# Altium project Oscilloscope.PrjPcb
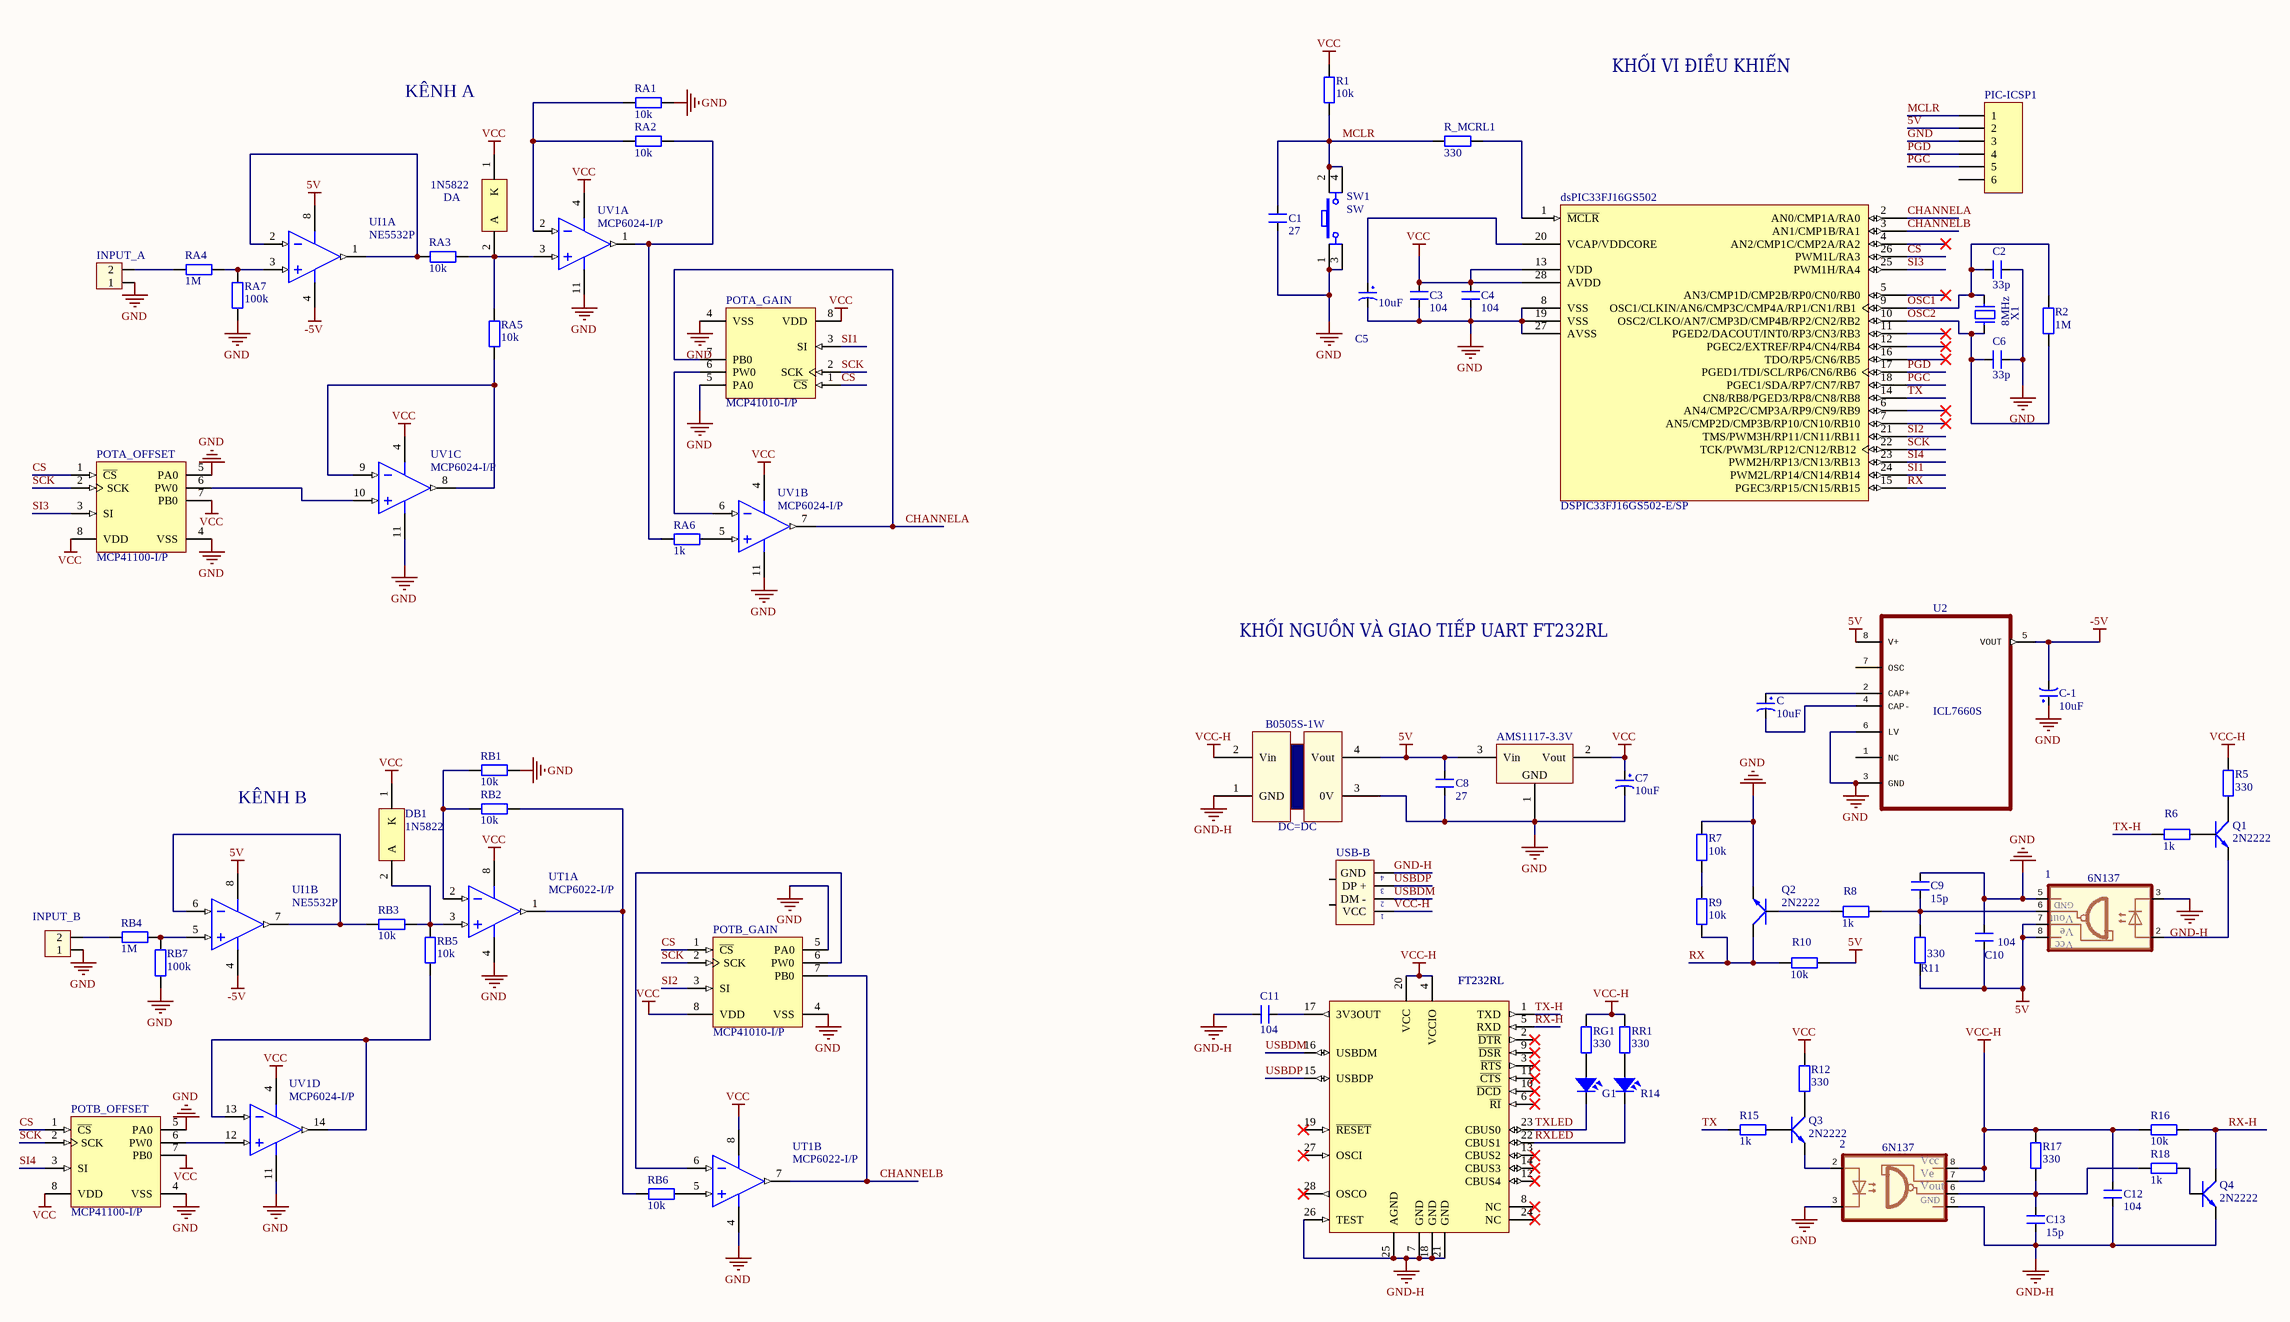
[diagram p0: Oscilloscope.SchDoc]
1 sheet, 74 parts. Net scope: global (net labels, ports and power ports of the same name join across sheets).
Board file: Oscilloscope.PcbDoc

## Sheet Oscilloscope.SchDoc
size A2; PageSetup: Record=PageOptions|CenterHorizontal=True|CenterVertical=True|PrintScale=1.00|XCorrection=1.00|YCorrection=1.00|PrintKind=2|BorderSize=5000000|LeftOffset=0|BottomOffset=0|Orientation=1|PaperLength=1000|PaperWidth=1000|Scale=100|PaperSource=7|PrintQuality=600|MediaType=1|DitherType=10|PrintScaleMode=0|PaperKind=A3|PaperIndex=8

### Parts
1  6N137  [DIP8/W0.3]
2  6N137  [DIP8/W0.3]
AMS1117-3.3V  AMS1117-3V3  [TO-252]  (value not drawn)
B0505S-1W  DC=DC  [B050S-1W]
C  10uF  [CP1/2]
C1  27  [CN1.5]
C2  33p  [CN1.5]
C3  104  [CN1.5]
C4  104  [CN1.5]
C5  10uF  [CP1/2]
C6  33p  [CN1.5]
C7  10uF  [CP1/2]
C8  27  [CN1.5]
C9  15p  [CN1.5]
C10  104  [CN1.5]
C11  104  [CN1.5]
C12  104  [CN1.5]
C13  15p  [CN1.5]
C-1  10uF  [CP1/2]
DA  1N5822  [ONSC-AXIAL_LEAD-2-267-05_V]
DB1  1N5822  [ONSC-AXIAL_LEAD-2-267-05_V]
dsPIC33FJ16GS502  DSPIC33FJ16GS502-E/SP  [DIP28W]
FT232RL  FT232RL  [DIP28W]
G1  LED  [LED-5-Green]  (value not drawn)
INPUT_A  Header 2  [HED2]  (value not drawn)
INPUT_B  Header 2  [HED2]  (value not drawn)
PIC-ICSP1  PIC-ICSP-UART  [HDR1X6 - L]  (value not drawn)
POTA_GAIN  MCP41010-I/P  [PDIP300-P8]
POTA_OFFSET  MCP41100-I/P  [PDIP300-P8]
POTB_GAIN  MCP41010-I/P  [PDIP300-P8]
POTB_OFFSET  MCP41100-I/P  [PDIP300-P8]
Q1  2N2222  [QTO-92]
Q2  2N2222  [QTO-92]
Q3  2N2222  [QTO-92]
Q4  2N2222  [QTO-92]
R1  10k  [R1/2W]
R2  1M  [R1/2W]
R5  330  [R1/4W]
R6  1k  [R1/4W]
R7  10k  [R1/4W]
R8  1k  [R1/4W]
R9  10k  [R1/4W]
R10  10k  [R1/4W]
R11  330  [R1/4W]
R12  330  [R1/4W]
R14  LED  [LED-5-RED]  (value not drawn)
R15  1k  [R1/4W]
R16  10k  [R1/4W]
R17  330  [R1/4W]
R18  1k  [R1/4W]
R_MCRL1  330  [R1/2W]
RA1  10k  [R1/2W]
RA2  10k  [R1/2W]
RA3  10k  [R1/2W]
RA4  1M  [R1/2W]
RA5  10k  [R1/2W]
RA6  1k  [R1/2W]
RA7  100k  [R1/2W]
RB1  10k  [R1/2W]
RB2  10k  [R1/2W]
RB3  10k  [R1/2W]
RB4  1M  [R1/2W]
RB5  10k  [R1/2W]
RB6  10k  [R1/2W]
RB7  100k  [R1/2W]
RG1  330  [R1/4W]
RR1  330  [R1/4W]
SW1  SW  [SW4]
U2  ICL7660S  [DIP-8]
UI1  NE5532P  [TI-P8]  (parts A,B of 2)
USB-B  USB  [USB-B-MALE]  (value not drawn)
UT1  MCP6022-I/P  [PDIP300-P8]  (parts A,B of 2)
UV1  MCP6024-I/P  [PDIP300-P14]  (parts A,B,C,D of 4)
X1  8MHz  [XT2]

### Nets
5V: 1.7(VE) 1.8(VCC) AMS1117-3.3V.3(Vin) B0505S-1W.4(Vout) C8.2 C10.1 PIC-ICSP1.2 R10.2 R11.1 U2.8(V+) UI1.8(VCC+)
-5V: C-1.2 U2.5(VOUT) UI1.4(VCC-)
GND: 1.5(GND) 2.3(C) AMS1117-3.3V.1(GND) B0505S-1W.3(0V) C1.1 C2.2 C3.1 C4.1 C5.2 C6.2 C7.2 C8.1 C9.2 C10.2 C-1.1 dsPIC33FJ16GS502.8(VSS) dsPIC33FJ16GS502.19(VSS) dsPIC33FJ16GS502.27(AVSS) INPUT_A.1 INPUT_B.1 PIC-ICSP1.3 POTA_GAIN.4(VSS) POTA_GAIN.5(PA0) POTA_OFFSET.4(VSS) POTA_OFFSET.5(PA0) POTB_GAIN.4(VSS) POTB_GAIN.5(PA0) POTB_OFFSET.4(VSS) POTB_OFFSET.5(PA0) Q2.1(E) R7.2 RA1.1 RA7.1 RB1.1 RB7.1 SW1.1 SW1.3 U2.3(GND) U2.6(LV) UT1.4(VSS) UV1.11(VSS)
GND-H: 1.3(C) 2.5(GND) B0505S-1W.1(GND) C11.1 C12.1 C13.1 FT232RL.7(GND) FT232RL.18(GND) FT232RL.21(GND) FT232RL.25(AGND) FT232RL.26(TEST) Q4.1(E) USB-B.4(GND)
VCC: AMS1117-3.3V.2(Vout) C3.2 C4.2 C7.1 DA.1(K) DB1.1(K) dsPIC33FJ16GS502.13(VDD) dsPIC33FJ16GS502.28(AVDD) POTA_GAIN.8(VDD) POTA_OFFSET.7(PB0) POTA_OFFSET.8(VDD) POTB_GAIN.8(VDD) POTB_OFFSET.7(PB0) POTB_OFFSET.8(VDD) R1.2 R12.2 UT1.8(VDD) UV1.4(VDD)
VCC-H: 2.7(VE) 2.8(VCC) B0505S-1W.2(Vin) C12.2 FT232RL.4(VCCIO) FT232RL.20(VCC) R5.2 R16.1 R17.2 RG1.2 RR1.2 USB-B.1(VCC)
CHANNELA: dsPIC33FJ16GS502.2(AN0/CMP1A/RA0) POTA_GAIN.7(PB0) UV1.7(VOUTB)
CHANNELB: dsPIC33FJ16GS502.3(AN1/CMP1B/RA1) POTB_GAIN.7(PB0) UT1.7(VOUTB)
CS: dsPIC33FJ16GS502.26(PWM1L/RA3) POTA_GAIN.1(~{CS}) POTA_OFFSET.1(~{CS}) POTB_GAIN.1(~{CS}) POTB_OFFSET.1(~{CS})
MCLR: C1.2 PIC-ICSP1.1 R1.1 R_MCRL1.2 SW1.2 SW1.4
OSC1: C2.1 dsPIC33FJ16GS502.9(OSC1/CLKIN/AN6/CMP3C/CMP4A/RP1/CN1/RB1) R2.2 X1.2
OSC2: C6.1 dsPIC33FJ16GS502.10(OSC2/CLKO/AN7/CMP3D/CMP4B/RP2/CN2/RB2) R2.1 X1.1
PGC: dsPIC33FJ16GS502.18(PGEC1/SDA/RP7/CN7/RB7) PIC-ICSP1.5
PGD: dsPIC33FJ16GS502.17(PGED1/TDI/SCL/RP6/CN6/RB6) PIC-ICSP1.4
RX: dsPIC33FJ16GS502.15(PGEC3/RP15/CN15/RB15) Q2.3(C) R9.1 R10.1
RX-H: FT232RL.5(RXD) Q4.3(C) R16.2
RXLED: FT232RL.22(CBUS1) R14.2
SCK: dsPIC33FJ16GS502.22(TCK/PWM3L/RP12/CN12/RB12) POTA_GAIN.2(SCK) POTA_OFFSET.2(SCK) POTB_GAIN.2(SCK) POTB_OFFSET.2(SCK)
SI1: dsPIC33FJ16GS502.24(PWM2L/RP14/CN14/RB14) POTA_GAIN.3(SI)
SI2: dsPIC33FJ16GS502.21(TMS/PWM3H/RP11/CN11/RB11) POTB_GAIN.3(SI)
SI3: dsPIC33FJ16GS502.25(PWM1H/RA4) POTA_OFFSET.3(SI)
SI4: dsPIC33FJ16GS502.23(PWM2H/RP13/CN13/RB13) POTB_OFFSET.3(SI)
TX: dsPIC33FJ16GS502.14(CN8/RB8/PGED3/RP8/CN8/RB8) R15.1
TX-H: FT232RL.1(TXD) R6.1
TXLED: FT232RL.23(CBUS0) G1.2
USBDM: FT232RL.16(USBDM) USB-B.2(DM_-)
USBDP: FT232RL.15(USBDP) USB-B.3(DP_+)
Net1_2: 1.2(A) Q1.1(E)
Net1_6: 1.6(VO) C9.1 R8.2 R11.2
Net2_2: 2.2(A) Q3.1(E)
Net2_6: 2.6(VO) C13.2 R17.1 R18.1
NetC5_1: C5.1 dsPIC33FJ16GS502.20(VCAP/VDDCORE)
NetC11_2: C11.2 FT232RL.17(3V3OUT)
NetC_1: C.1 U2.2(CAP+)
NetC_2: C.2 U2.4(CAP-)
NetDA_2: DA.2(A) RA3.1 RA5.1 UV1.3(VINA+)
NetDB1_2: DB1.2(A) RB3.1 RB5.2 UT1.3(VINA+)
NetdsPIC33FJ16GS502_1: dsPIC33FJ16GS502.1(~{MCLR}) R_MCRL1.1
NetG1_1: G1.1 RG1.1
NetINPUT_A_2: INPUT_A.2 RA4.2
NetINPUT_B_2: INPUT_B.2 RB4.2
NetPOTA_GAIN_6: POTA_GAIN.6(PW0) UV1.6(VINB-)
NetPOTA_OFFSET_6: POTA_OFFSET.6(PW0) UV1.10(VINC+)
NetPOTB_GAIN_6: POTB_GAIN.6(PW0) UT1.6(VINB-)
NetPOTB_OFFSET_6: POTB_OFFSET.6(PW0) UV1.12(VIND+)
NetQ1_2: Q1.2(B) R6.2
NetQ1_3: Q1.3(C) R5.1
NetQ2_2: Q2.2(B) R8.1
NetQ3_2: Q3.2(B) R15.2
NetQ3_3: Q3.3(C) R12.1
NetQ4_2: Q4.2(B) R18.2
NetR7_1: R7.1 R9.2
NetR14_1: R14.1 RR1.1
NetRA1_2: RA1.2 RA2.2 UV1.2(VINA-)
NetRA2_1: RA2.1 RA6.2 UV1.1(VOUTA)
NetRA3_2: RA3.2 UI1.1(OUT1) UI1.2(IN1-)
NetRA4_1: RA4.1 RA7.2 UI1.3(IN1+)
NetRA5_2: RA5.2 UV1.8(VOUTC) UV1.9(VINC-)
NetRA6_1: RA6.1 UV1.5(VINB+)
NetRB1_2: RB1.2 RB2.2 UT1.2(VINA-)
NetRB2_1: RB2.1 RB6.2 UT1.1(VOUTA)
NetRB3_2: RB3.2 UI1.6(IN2-) UI1.7(OUT2)
NetRB4_1: RB4.1 RB7.2 UI1.5(IN2+)
NetRB5_1: RB5.1 UV1.13(VIND-) UV1.14(VOUTD)
NetRB6_1: RB6.1 UT1.5(VINB+)

Not connected (* = marked no-connect by the designer): dsPIC33FJ16GS502 4(AN2/CMP1C/CMP2A/RA2)* 5(AN3/CMP1D/CMP2B/RP0/CN0/RB0)* 6(AN4/CMP2C/CMP3A/RP9/CN9/RB9)* 7(AN5/CMP2D/CMP3B/RP10/CN10/RB10)* 11(PGED2/DACOUT/INT0/RP3/CN3/RB3)* 12(PGEC2/EXTREF/RP4/CN4/RB4)* 16(TDO/RP5/CN6/RB5)*; FT232RL 2(~{DTR})* 3(~{RTS})* 6(~{RI})* 8(NC)* 9(~{DSR})* 10(~{DCD})* 11(~{CTS})* 12(CBUS4)* 13(CBUS2)* 14(CBUS3)* 19(~{RESET})* 24(NC)* 27(OSCI)* 28(OSCO)*; PIC-ICSP1 6; U2 1(NC) 7(OSC); USB-B 5 6

### Notes on the sheet
- KÊNH A
- KHỐI VI ĐIỀU KHIỂN
- KHỐI NGUỒN VÀ GIAO TIẾP UART FT232RL
- KÊNH B
- (in symbol 6N137) Vcc; Ve; Vout

### Library data of the parts
B0505S-1W = B050S-1W: NGUON CACH LY
C C5 C7 C-1 = CP1: Cap P  0,1uF < 22uF , 16 - 50V; Value: 10uF/50V; Description 1: 10 => 220uF/6,3V/10V - 10uF => 100uF/16V; Description 2: 0,1uF => 33uF/50V - 10uF => 22uF/63V; Description 3: 0,47uF => 10uF/100V
C1-C4 C6 C8 C9 C11 C13 = CN1.5: Cap np 682pF => 104pF; Value: 0.01uF
C10 C12 = CN1.5: Cap np 682pF => 104pF; Value: 104
DA DB1 = 1N5822: Rectifier, 2-Pin Axial_Lead, Bulk Bag; Manufacturer: On Semiconductor; Note: 0; Configuration: Single; IFSM Max (A): 80; DatasheetVersion: Rev. 10; PackageVersion: Rev. G, 06/2000; PackageReference: AXIAL_LEAD-2-267-05; PackageDescription: 2-Pin, Axial Lead, Diameter 5.05 mm; Packing: Bulk Bag; RoHS: FALSE; Mounting Technology: Through Hole; PartNumber: 1N5822; ComponentLink1Description: Manufacturer URL; ComponentLink1URL: http://www.onsemi.com/; ComponentLink2Description: Datasheet; ComponentLink2URL: http://www.onsemi.cn/pub_link/Collateral/1N5820-D.PDF; ComponentLink3Description: Package Specification; ComponentLink3URL: http://www.onsemi.com/pub_link/Collateral/267-05.PDF
dsPIC33FJ16GS502 = DSPIC33FJ16GS502-E/SP: High-Performance 16-bit Digital Signal Controller, 16 KB Flash, 2 KB RAM , 28-Pin SPDIP, Extended High Temperature; Published: 2-Dec-2009; DatasheetVersion: revD, Mar-2009; PackageVersion: revBB, Aug-2009; PackageReference: SPDIP300-SP28; Publisher: Altium Limited; PackageDescription: 28-Lead Skinny Plastic Dual In-Line (SP) - 300 mil Body [SPDIP]; Supplier 1: Digi-Key; Supplier Part Number 1: DSPIC33FJ16GS502-E/SP-ND; ComponentLink1Description: Datasheet; ComponentLink1URL: http://ww1.microchip.com/downloads/en/DeviceDoc/70318D.pdf; ComponentLink2Description: Packaging Specification; ComponentLink2URL: http://www.microchip.com/stellent/groups/techpub_sg/documents/packagingspec/en012702.pdf; ComponentLink3Description: Microchip.com Home; ComponentLink3URL: http://www.microchip.com/
FT232RL = FT232RL-Tube: USB UART Asynchronous Serial Data Transfer Chip, 28-pin SSOP, Tube; Manufacturer: FTDI; DatasheetVersion: ver 2.10, Mar-2012; PackageVersion: Mar-12; PackageReference: SSOP-28; PackageDescription: 28-Pin Small Outline Package 0.65 mm Pitch; PartNumber: FT232RL-Tube; ComponentLink1Description: Manufacturer URL; ComponentLink1URL: http://www.ftdichip.com/; ComponentLink2Description: Datasheet; ComponentLink2URL: http://www.ftdichip.com/Support/Documents/DataSheets/ICs/DS_FT232R.pdf
G1 R14 = LED: LED Single colour Green and Red; Value: LED 3 ly Single Colour
INPUT_A INPUT_B = Hed2: Header 2 (Green); Value: Header 2
PIC-ICSP1 = Header 6L: Header, 6-Pin; LatestRevisionDate: 17-Jul-2002; LatestRevisionNote: Re-released for DXP Platform.; Publisher: Altium Limited
POTA_GAIN POTA_OFFSET POTB_GAIN POTB_OFFSET = MCP41100-I/P: Single/Dual Digital Potentiometer with SPI Interface, 8-Pin PDIP, Industrial Temperature; Published: 29-Jan-2009; DatasheetVersion: Jul-2003; PackageVersion: revBB, Aug-2009; PackageReference: PDIP300-P8; Publisher: Altium Limited; PackageDescription: 8-Lead Plastic Dual In-Line (P) - 300 mil Body [PDIP]; Supplier 1: Digi-Key; Supplier Part Number 1: MCP41100-I/P-ND; Supplier 2: Farnell; Supplier Part Number 2: 1557412; Code_JEDEC: MS-001; ComponentLink1Description: Datasheet; ComponentLink1URL: http://ww1.microchip.com/downloads/en/DeviceDoc/11195c.pdf; ComponentLink2Description: Packaging Specification; ComponentLink2URL: http://www.microchip.com/stellent/groups/techpub_sg/documents/packagingspec/en012702.pdf; ComponentLink3Description: Microchip.com Home; ComponentLink3URL: http://www.microchip.com/
Q1-Q4 = NPN_EBC: P 600mW, EBC; Value: C9014
R1 R2 R5-R12 R15-R18 R_MCRL1 RA1-RA7 RB1-RB7 RG1 RR1 = R1/4W: Resistor 1/4W; Value: R1/4W - 1K
SW1 = SW4: Switch button 4 pin; Value: Button chip 4 pin
U2 = ICL7660CPAZ
UI1 = NE5532P: Dual Low-Noise High-Speed Audio Operational Amplifier, 10 to 30 V, 0 to 70 degC, 8-pin DIP (P8), Pb-Free (RoHS); Manufacturer: Texas Instruments; CMRR(Min)(dB): 70; GBW(Typ)(MHz): 10; IIB(Max)(pA): 800000; Iq per channel(Max)(mA): 4; Number of Channels: 2; Slew Rate(Typ)(V/us): 9; Sub Family: General Purpose Amplifier, High Supply Voltage Amplifier (>=30V), Low Noise Amp (<=10nV/rtHz); Total Supply Voltage(Max)(+5V is 5, +/-5V is 10): 30; Vn at 1kHz(Typ)(nV/rtHz): 5; DatasheetVersion: SLOS075I; PackageVersion: 4040082/E, 04/2010; PackageReference: P8; PackageDescription: 8-Pin Plastic In-Line, Body 9.59 x 6.35 mm, Pitch 2.54 mm; Supplier 1: Digi-Key; Supplier Part Number 1: 296-1410-5-ND; Supplier 2: Farnell; Supplier Part Number 2: 1106092; Supplier 3: Farnell; Supplier Part Number 3: 2119505; Supplier 4: Newark; Supplier Part Number 4: 59K8751; Supplier 5: Mouser; Supplier Part Number 5: 595-NE5532P; Eco-Plan: Pb-Free (RoHS); Total Supply Voltage(Min)(+5V is 5, +/-5V is 10): 10; Vio (25C)(Max)(mV): 4; Mounting Technology: Through Hole; Code_JEDEC: MS-001; PartNumber: NE5532P; ComponentLink1Description: Manufacturer URL; ComponentLink1URL: http://www.ti.com/; ComponentLink2Description: Datasheet; ComponentLink2URL: http://www.ti.com/lit/ds/symlink/ne5532.pdf; ComponentLink3Description: Package Specification; ComponentLink3URL: http://www.ti.com/litv/pdf/mpdi001b
USB-B = USB: USB connector; Value: USB
UT1 = MCP6022-I/P: Rail-to-Rail Input/Output, 10 MHz Operational Amplifier, 8-Pin PDIP, Industrial Temperature; Manufacturer: Microchip; DatasheetVersion: revD, Feb-2009; PackageVersion: revBB, Aug-2009; PackageReference: PDIP300-P8; PackageDescription: 8-Lead Plastic Dual In-Line (P) - 300 mil Body [PDIP]; Supplier 1: Digi-Key; Supplier Part Number 1: MCP6022-I/P-ND; Supplier 2: Farnell; Supplier Part Number 2: 9758640; Supplier 3: Newark; Supplier Part Number 3: 96K3737; Supplier 4: Mouser; Supplier Part Number 4: 579-MCP6022IP; Mounting Technology: Through Hole; Code_JEDEC: MS-001; PartNumber: MCP6022-I/P; ComponentLink1Description: Manufacturer URL; ComponentLink1URL: http://www.microchip.com/; ComponentLink2Description: Datasheet; ComponentLink2URL: http://ww1.microchip.com/downloads/en/DeviceDoc/21685d.pdf; ComponentLink3Description: Package Specification; ComponentLink3URL: http://www.microchip.com/stellent/groups/techpub_sg/documents/packagingspec/en012702.pdf
UV1 = MCP6024-I/P: Rail-to-Rail Input/Output, 10 MHz Operational Amplifier, 14-Pin PDIP, Industrial Temperature; Manufacturer: Microchip; DatasheetVersion: revD, Feb-2009; PackageVersion: revBB, Aug-2009; PackageReference: PDIP300-P14; PackageDescription: 14-Lead Plastic Dual In-Line (P) - 300 mil Body [PDIP]; Supplier 1: Digi-Key; Supplier Part Number 1: MCP6024-I/P-ND; Supplier 2: Farnell; Supplier Part Number 2: 1627199; Supplier 3: Newark; Supplier Part Number 3: 73K1004; Supplier 4: Mouser; Supplier Part Number 4: 579-MCP6024-I/P; Mounting Technology: Through Hole; PartNumber: MCP6024-I/P; ComponentLink1Description: Manufacturer URL; ComponentLink1URL: http://www.microchip.com/; ComponentLink2Description: Datasheet; ComponentLink2URL: http://ww1.microchip.com/downloads/en/DeviceDoc/21685d.pdf; ComponentLink3Description: Package Specification; ComponentLink3URL: http://www.microchip.com/stellent/groups/techpub_sg/documents/packagingspec/en012702.pdf
X1 = XT2: Crystal For all Crystal 2pin.; Value: 4Mhz